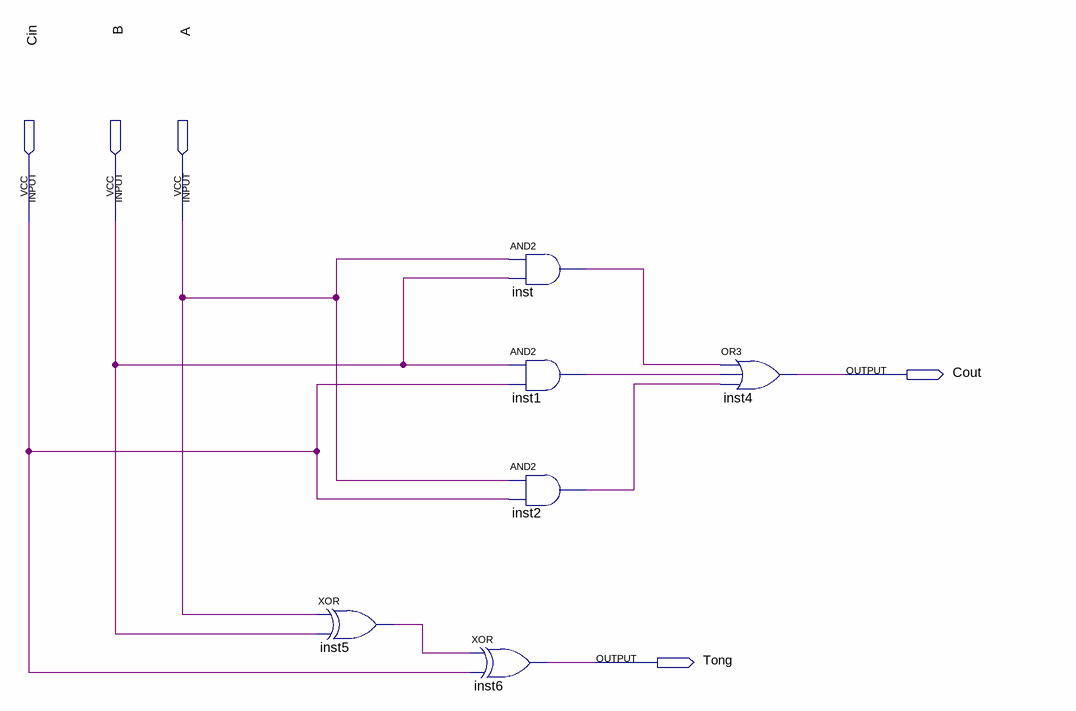
[diagram p0: schematic sheet]
// Quartus schematic Full_adder_1bit.bdf as structural Verilog: 6 symbols, 5 pins
module Full_adder_1bit (
  input  Cin,
  input  B,
  input  A,
  output Cout,
  output Tong
);

  wire inst1_out, inst2_out, inst5_out, inst_out;

  xor inst5 (inst5_out, A, B);
  xor inst6 (Tong, inst5_out, Cin);
  and inst (inst_out, A, B);
  and inst1 (inst1_out, B, Cin);
  and inst2 (inst2_out, A, Cin);
  or inst4 (Cout, inst_out, inst1_out, inst2_out);
endmodule
